# EAGLE design pic18f13k50_2 (EAGLE 6.5.0)
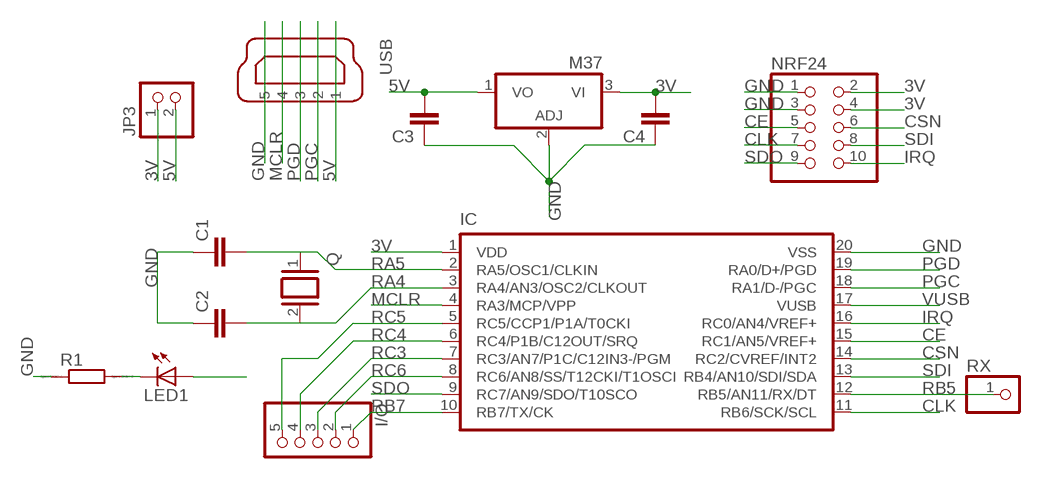
[diagram p0: schematic, sheet 1]

## Parts
C1  C-EUC0805  [C0805]
C2  C-EUC0805  [C0805]
C3  C-EU025-025X050  [C025-025X050]
C4  C-EU025-025X050  [C025-025X050]
I/O  PINHD-1X5  [1X05]
IC  PIC18F13K50  [SSOP20]
JP3  PINHD-1X2  [1X02]
LED1  LEDCHIP-LED0805  [CHIP-LED0805]
M37  337IMP  [SOT223]
NRF24  PINHD-2X5  [2X05]
Q  XTAL/S  [QS]
R1  R  [R0805]
RX  PINHD-1X1  [1X01]
USB  MINI-USB-32005-201  [32005-201]

## Nets
3V: C4.2 IC.1(VDD) JP3.1 M37.3(VI) NRF24.2 NRF24.4
5V: C3.2 JP3.2 M37.1(VO) USB.1
CE: IC.15(RC1/AN5/VREF+) NRF24.5
CLK: IC.11(RB6/SCK/SCL) NRF24.7
CSN: IC.14(RC2/CVREF/INT2) NRF24.6
GND: C1.1 C2.1 C3.1 C4.1 IC.20(VSS) M37.2(ADJ) NRF24.1 NRF24.3 R1.1 USB.5
IRQ: IC.16(RC0/AN4/VREF+) NRF24.10
MCLR: IC.4(RA3/MCP/VPP) USB.4
N$1: LED1.C R1.2
PGC: IC.18(RA1/D-/PGC) USB.2
PGD: IC.19(RA0/D+/PGD) USB.3
RA4: C2.2 IC.3(RA4/AN3/OSC2/CLKOUT) Q.2
RA5: C1.2 IC.2(RA5/OSC1/CLKIN) Q.1
RB5: IC.12(RB5/AN11/RX/DT) RX.1
RB7: I/O.1 IC.10(RB7/TX/CK) LED1.A
RC3: I/O.3 IC.7(RC3/AN7/P1C/C12IN3-/PGM)
RC4: I/O.4 IC.6(RC4/P1B/C12OUT/SRQ)
RC5: I/O.5 IC.5(RC5/CCP1/P1A/T0CKI)
RC6: I/O.2 IC.8(RC6/AN8/SS/T12CKI/T1OSCI)
SDI: IC.13(RB4/AN10/SDI/SDA) NRF24.8
SDO: IC.9(RC7/AN9/SDO/T10SCO) NRF24.9
VUSB: IC.17(VUSB)

## Library data of the parts
C1 C2 = rcl:C-EU: CAPACITOR, European symbol
C3 C4 = qfm-trx1-24g:C-EU: CAPACITOR, European symbol
I/O = pinhead:PINHD-1X5: PIN HEADER
IC = microchip-7:PIC18F13K50
JP3 = pinhead:PINHD-1X2: PIN HEADER
LED1 = led:LED: LED OSRAM: - CHIPLED LG R971, LG N971, LY N971, LG Q971, LY Q971, LO R971, LY R971 LH N974, LH R974 LS Q976, LO Q976, LY Q976 LO Q996 - Hyper CHIPLED LW Q18S LB Q993, LB Q99A, LB R99A - SideLED LS A670, LO A670, LY A670, LG A670, LP A670 LB A673, LV A673, LT A673, LW A673 LH A674 LY A675 LS A676, LA A676, LO A676, LY A676, LW A676 LS A679, LY A679, LG A679 - Hyper Micro SIDELED® LS Y876, LA Y876, LO Y876, LY Y876 LT Y87S - SmartLED LW L88C, LW L88S LB L89C, LB L89S, LG L890 LS L89K, LO L89K, LY L89K LS L896, LA L896, LO L896, LY L896 - TOPLED LS T670, LO T670, LY T670, LG T670, LP T670 LSG T670, LSP T670, LSY T670, LOP T670, LYG T670 LG T671, LOG T671, LSG T671 LB T673, LV T673, LT T673, LW T673 LH T674 LS T676, LA T676, LO T676, LY T676, LB T676, LH T676, LSB T676, LW T676 LB T67C, LV T67C, LT T67C, LS T67K, LO T67K, LY T67K, LW E67C LS E67B, LA E67B, LO E67B, LY E67B, LB E67C, LV E67C, LT E67C LW T67C LS T679, LY T679, LG T679 LS T770, LO T770, LY T770, LG T770, LP T770 LB T773, LV T773, LT T773, LW T773 LH T774 LS E675, LA E675, LY E675, LS T675 LS T776, LA T776, LO T776, LY T776, LB T776 LHGB T686 LT T68C, LB T68C - Hyper Mini TOPLED® LB M676 - Mini TOPLED Santana® LG M470 LS M47K, LO M47K, LY M47K Source: http://www.osram.convergy.de LUXEON: - LUMILED® LXK2-PW12-R00, LXK2-PW12-S00, LXK2-PW14-U00, LXK2-PW14-V00 LXK2-PM12-R00, LXK2-PM12-S00, LXK2-PM14-U00 LXK2-PE12-Q00, LXK2-PE12-R00, LXK2-PE12-S00, LXK2-PE14-T00, LXK2-PE14-U00 LXK2-PB12-K00, LXK2-PB12-L00, LXK2-PB12-M00, LXK2-PB14-N00, LXK2-PB14-P00, LXK2-PB14-Q00 LXK2-PR12-L00, LXK2-PR12-M00, LXK2-PR14-Q00, LXK2-PR14-R00 LXK2-PD12-Q00, LXK2-PD12-R00, LXK2-PD12-S00 LXK2-PH12-R00, LXK2-PH12-S00 LXK2-PL12-P00, LXK2-PL12-Q00, LXK2-PL12-R00 Source: www.luxeon.com KINGBRIGHT: KA-3528ASYC Source: www.kingbright.com
M37 = linear:*337: Negative VOLTAGE REGULATOR
NRF24 = pinhead:PINHD-2X5: PIN HEADER
Q = special:XTAL/S: CRYSTAL
R1 = eagle-ltspice:R: RESISTOR, European symbol; SPICEMODEL: NONE; SPICEPREFIX: R
RX = pinhead:PINHD-1X1: PIN HEADER
USB = con-cypressindustries 2:MINI-USB-: MINI USB-B Conector Source: www.cypressindustries.com

## Board
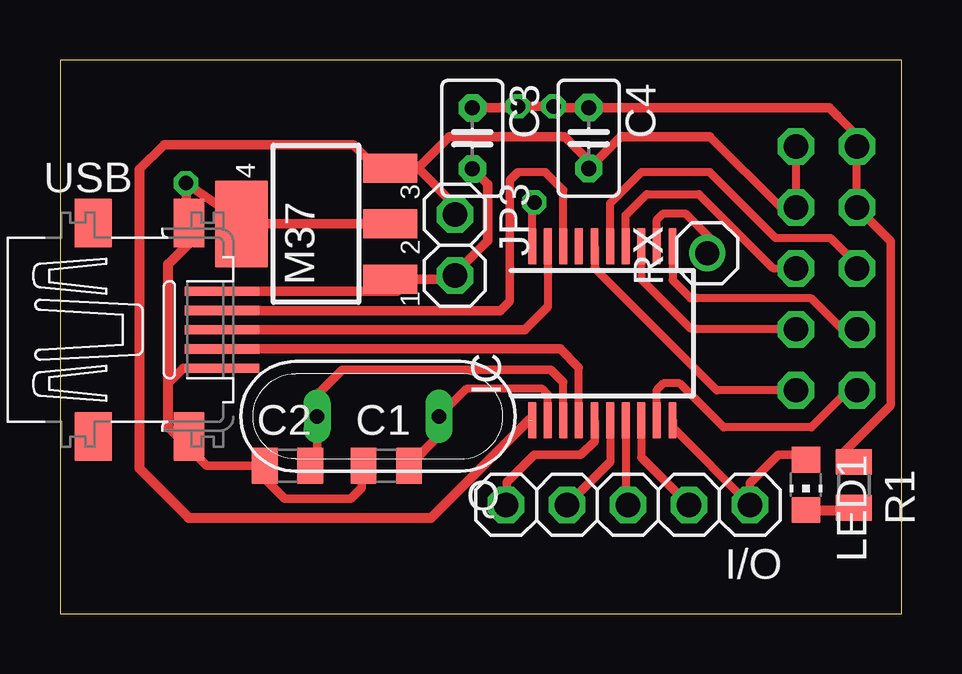
[diagram p1: board, top side]
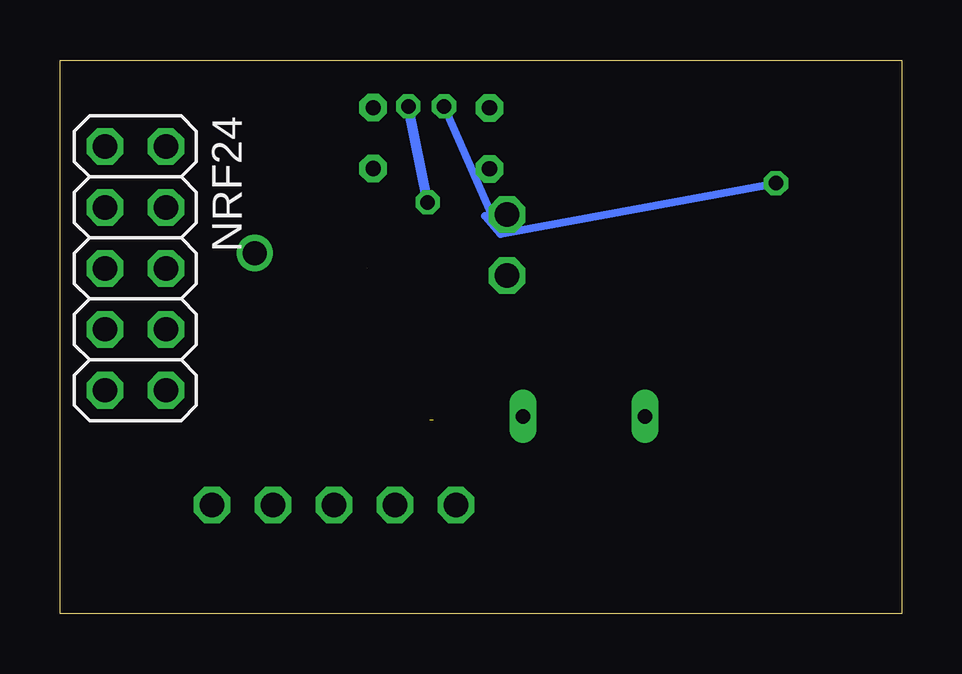
[diagram p2: board, bottom side, seen from below]

Size 35.08 x 23.08 mm. Coordinates in mm from the lower left corner, seen from the top.
Outline: 35.08,0 35.08,23.08 0,23.08 0,0 35.08,0
Copper layers (1*16): Top 0.035mm / dielectric 1.5mm / Bottom 0.035mm
Design rules "default": minimum track width 10mil, minimum drill 24mil, track to track 8mil, track to pad 8mil, pad to pad 8mil, via to via 8mil, smd to smd 8mil, copper to edge 40mil, drill to drill 8mil, minimum pad ring 10mil, minimum via ring 8mil, stop-mask expansion 4mil, vias tented up to drill 0mil, thermal gap 10mil

### Footprints (pad centres in the part's own frame; a part is rotated, then mirrored left to right if it is on the bottom)
C0805 = smd 1.071 x 1.5: 1 -0.95,0; 2 0.95,0
C025-025X050 = drill 0.635 octagon: 1 -1.27,0; 2 1.27,0
1X05 = drill 1.016 octagon: 1 -5.08,0; 2 -2.54,0; 3 0,0; 4 2.54,0; 5 5.08,0
SSOP20 = smd 0.33 x 1.5: 1 -2.925,-3.625; 2 -2.275,-3.625; 3 -1.625,-3.625; 4 -0.975,-3.625; 5 -0.325,-3.625; 6 0.325,-3.625; 7 0.975,-3.625; 8 1.625,-3.625; 9 2.275,-3.625; 10 2.925,-3.625; 11 2.925,3.625; 12 2.275,3.625; 13 1.625,3.625; 14 0.975,3.625; 15 0.325,3.625; 16 -0.325,3.625; 17 -0.975,3.625; 18 -1.625,3.625; 19 -2.275,3.625; 20 -2.925,3.625
1X02 = drill 1.016 octagon: 1 -1.27,0; 2 1.27,0
CHIP-LED0805 = smd 1.2 x 1.073: A 0,-1.05; C 0,1.05
SOT223 = smd 1.219 x 2.235: 1 -2.311,-3.099; 2 0,-3.099; 3 2.311,-3.099 | smd 3.6 x 2.2: 4 0,3.099
2X05 = drill 1.016 octagon: 1 -5.08,-1.27; 2 -5.08,1.27; 3 -2.54,-1.27; 4 -2.54,1.27; 5 0,-1.27; 6 0,1.27; 7 2.54,-1.27; 8 2.54,1.27; 9 5.08,-1.27; 10 5.08,1.27
QS = drill 0.61 long: 1 -2.54,0; 2 2.54,0
R0805 = smd 1.071 x 1.5: 1 -0.95,0; 2 0.95,0
1X01 = drill 1: 1 0,0
32005-201 = smd 3.1 x 0.381: 1 3,1.6; 2 3,0.8; 3 3,0; 4 3,-0.8; 5 3,-1.6 | smd 1.524 x 2.032: M1 -2.365,-4.45; M2 -2.365,4.45 | smd 1.27 x 2.032: M3 1.63,4.45; M4 1.63,-4.45

### Placement (x,y rotation side)
C1  13.59,6.17 0 top
C2  9.48,6.17 0 top
C3  17.18,19.81 270 top
C4  22.03,19.82 270 top
I/O  23.67,4.54 180 top
IC  22.6,11.7 0 top
JP3  16.46,15.36 270 top
LED1  31.08,5.37 180 top
M37  10.66,16.25 90 top
NRF24  31.94,14.4 270 bottom
Q  13.25,8.23 180 top
R1  33.08,5.37 270 top
RX  26.96,15.03 90 top
USB  3.75,11.84 0 top

### Tracks (layer width: path | path; a pad name or v marks a point on that pad's centre or on a via)
3V  (1 unrouted)
  Top 0.33: NRF24.2 NRF24.4 30.03,16.94 27.08,19.89
  Top 0.39: 27.08,19.89 23.37,19.89 C4.2 22.03,18.88 21.02,19.89 16.23,19.89 14.96,18.62 14.96,18.52 | 14.96,18.52 16.46,17.02 JP3.1 | 14.96,18.52 13.81,18.52 M37.3 | 14.96,18.52 14.62,18.86 12.91,18.86 12.22,19.55 4.33,19.55 3.3,18.52
  Top 0.406: 3.3,18.52 3.3,6.06 5.36,4 15.46,4 19.54,8.07
5V
  Top 0.39: USB.1 14.06,13.44 M37.1 16.3,13.94 JP3.2 16.46,14.18 17.82,15.54 17.82,17.9 C3.2
CE
  Top 0.33: NRF24.5 33.21,14.56 32.11,15.66 29.82,15.66 27.08,18.4 24.22,18.4 22.96,17.14
  Top 0.335: IC.15 22.92,17.1 22.96,17.14
CLK
  Top 0.33: NRF24.7 32.6,11.86 31.31,13.14 26.28,13.14 25.52,13.9
  Top 0.335: IC.11 25.52,13.9
CSN
  Top 0.33: 23.57,16.61 24.45,17.49 26.62,17.49 29.71,14.4 30.62,14.4 30.74,14.4
  Top 0.335: IC.14 23.57,16.61 | NRF24.6 30.63,14.4 30.62,14.4
GND  (via drill 0.6)
  Top 0.33: NRF24.1 NRF24.3 33.21,19.93 32.39,20.75 32.11,21.03
  Top 0.335: IC.20 19.67,17.17 v19.76,17.14 | 5.25,15.77 v5.25,17.95
  Top 0.345: 32.66,6.51 32.66,6.72 34.62,8.69 34.62,15.52 NRF24.3 | 4.5,7.77 6.11,6.17 C2.1 8.53,5.64 9.36,4.8 12.11,4.8 12.56,5.26 12.56,6.09 C1.1
  Top 0.39: 4.5,9.6 5.14,10.24 USB.5 | 5.65,15.72 5.3,15.72 v5.25,17.95 7.74,16.25 M37.2 | C3.1 19.02,21.08 v19.08,21.15 v20.56,21.15 20.62,21.09 C4.1 32.05,21.09 32.39,20.75
  Top 0.406: 4.5,7.77 4.5,9.6 4.5,14.57 5.65,15.72 5.82,15.89 | 32.66,6.51 R1.1
  Bottom 0.33: v19.08,21.15 16.73,15.83 17.36,16.57
  Bottom 0.335: 16.73,15.83 v5.25,17.95
  Bottom 0.406: v19.76,17.14 v20.56,21.15
IRQ  (1 unrouted)
  Top 0.33: NRF24.10 27.36,9.32 22.28,14.4 | IC.16 22.27,15.09
  Top 0.335: 22.27,15.09 22.27,14.41
MCLR
  Top 0.335: IC.4 21.62,10.26
  Top 0.36: 21.62,10.26 20.84,11.04
  Top 0.39: USB.4 20.84,11.04
N$1
  Top 0.406: 32.64,4.34 R1.2 32.92,4.32 LED1.C
PGC
  Top 0.335: 19.08,18.4 20.22,18.4 20.97,17.65 IC.18
  Top 0.345: 18.74,18.06 19.08,18.4
  Top 0.36: 18.74,13.03 18.74,18.06
  Top 0.38: 18.34,12.64 18.74,13.03
  Top 0.39: USB.2 18.34,12.64
PGD
  Top 0.335: IC.19 20.32,12.79
  Top 0.36: 19.37,11.84 20.32,12.79
  Top 0.39: USB.3 19.37,11.84
RA4
  Top 0.335: IC.3 20.97,9.65
  Top 0.345: C2.2 10.43,6.48 10.39,6.51
  Top 0.36: 20.97,9.65 20.45,10.17 11.76,10.17 10.73,9.14 10.73,8.25 Q.2 10.71,6.49 10.39,6.51
RA5
  Top 0.335: Q.1 16.93,9.37 20.11,9.37 20.32,9.16 IC.2
  Top 0.345: Q.1 15.79,7.42 C1.2
  Top 0.36: Q.1 15.76,8.23
RB5
  Top 0.32: 27.31,15.43 RX.1
  Top 0.335: IC.12 24.87,16.42 25.14,16.69 26.05,16.69 27.31,15.43
RB7
  Top 0.335: 25.52,7.77 I/O.1
  Top 0.345: IC.10 25.52,7.77 | I/O.1 28.75,5.44 29.94,6.63 30.6,6.63 LED1.A
RC3
  Top 0.335: IC.7 23.57,4.64
  Top 0.345: 23.57,4.64 I/O.3
RC4
  Top 0.335: IC.6 22.92,6.34
  Top 0.345: 22.92,6.34 I/O.4
RC5
  Top 0.335: IC.5 22.27,7.19
  Top 0.345: 22.27,7.19 21.71,6.63 19.76,6.63 18.62,5.49 18.62,4.58 I/O.5
RC6
  Top 0.335: IC.8 24.22,6.53
  Top 0.345: 24.22,6.53 I/O.2
SDI
  Top 0.33: 24.22,13.95 26.28,11.89 30.64,11.89 NRF24.8
  Top 0.335: IC.13 24.22,13.95
SDO
  Top 0.33: NRF24.9 32.85,9.32 31.31,7.77 27.65,7.77 25.82,9.6 25.14,9.6 24.87,9.34
  Top 0.335: IC.9 24.87,9.34